# EAGLE design licht (EAGLE 6.6.0)
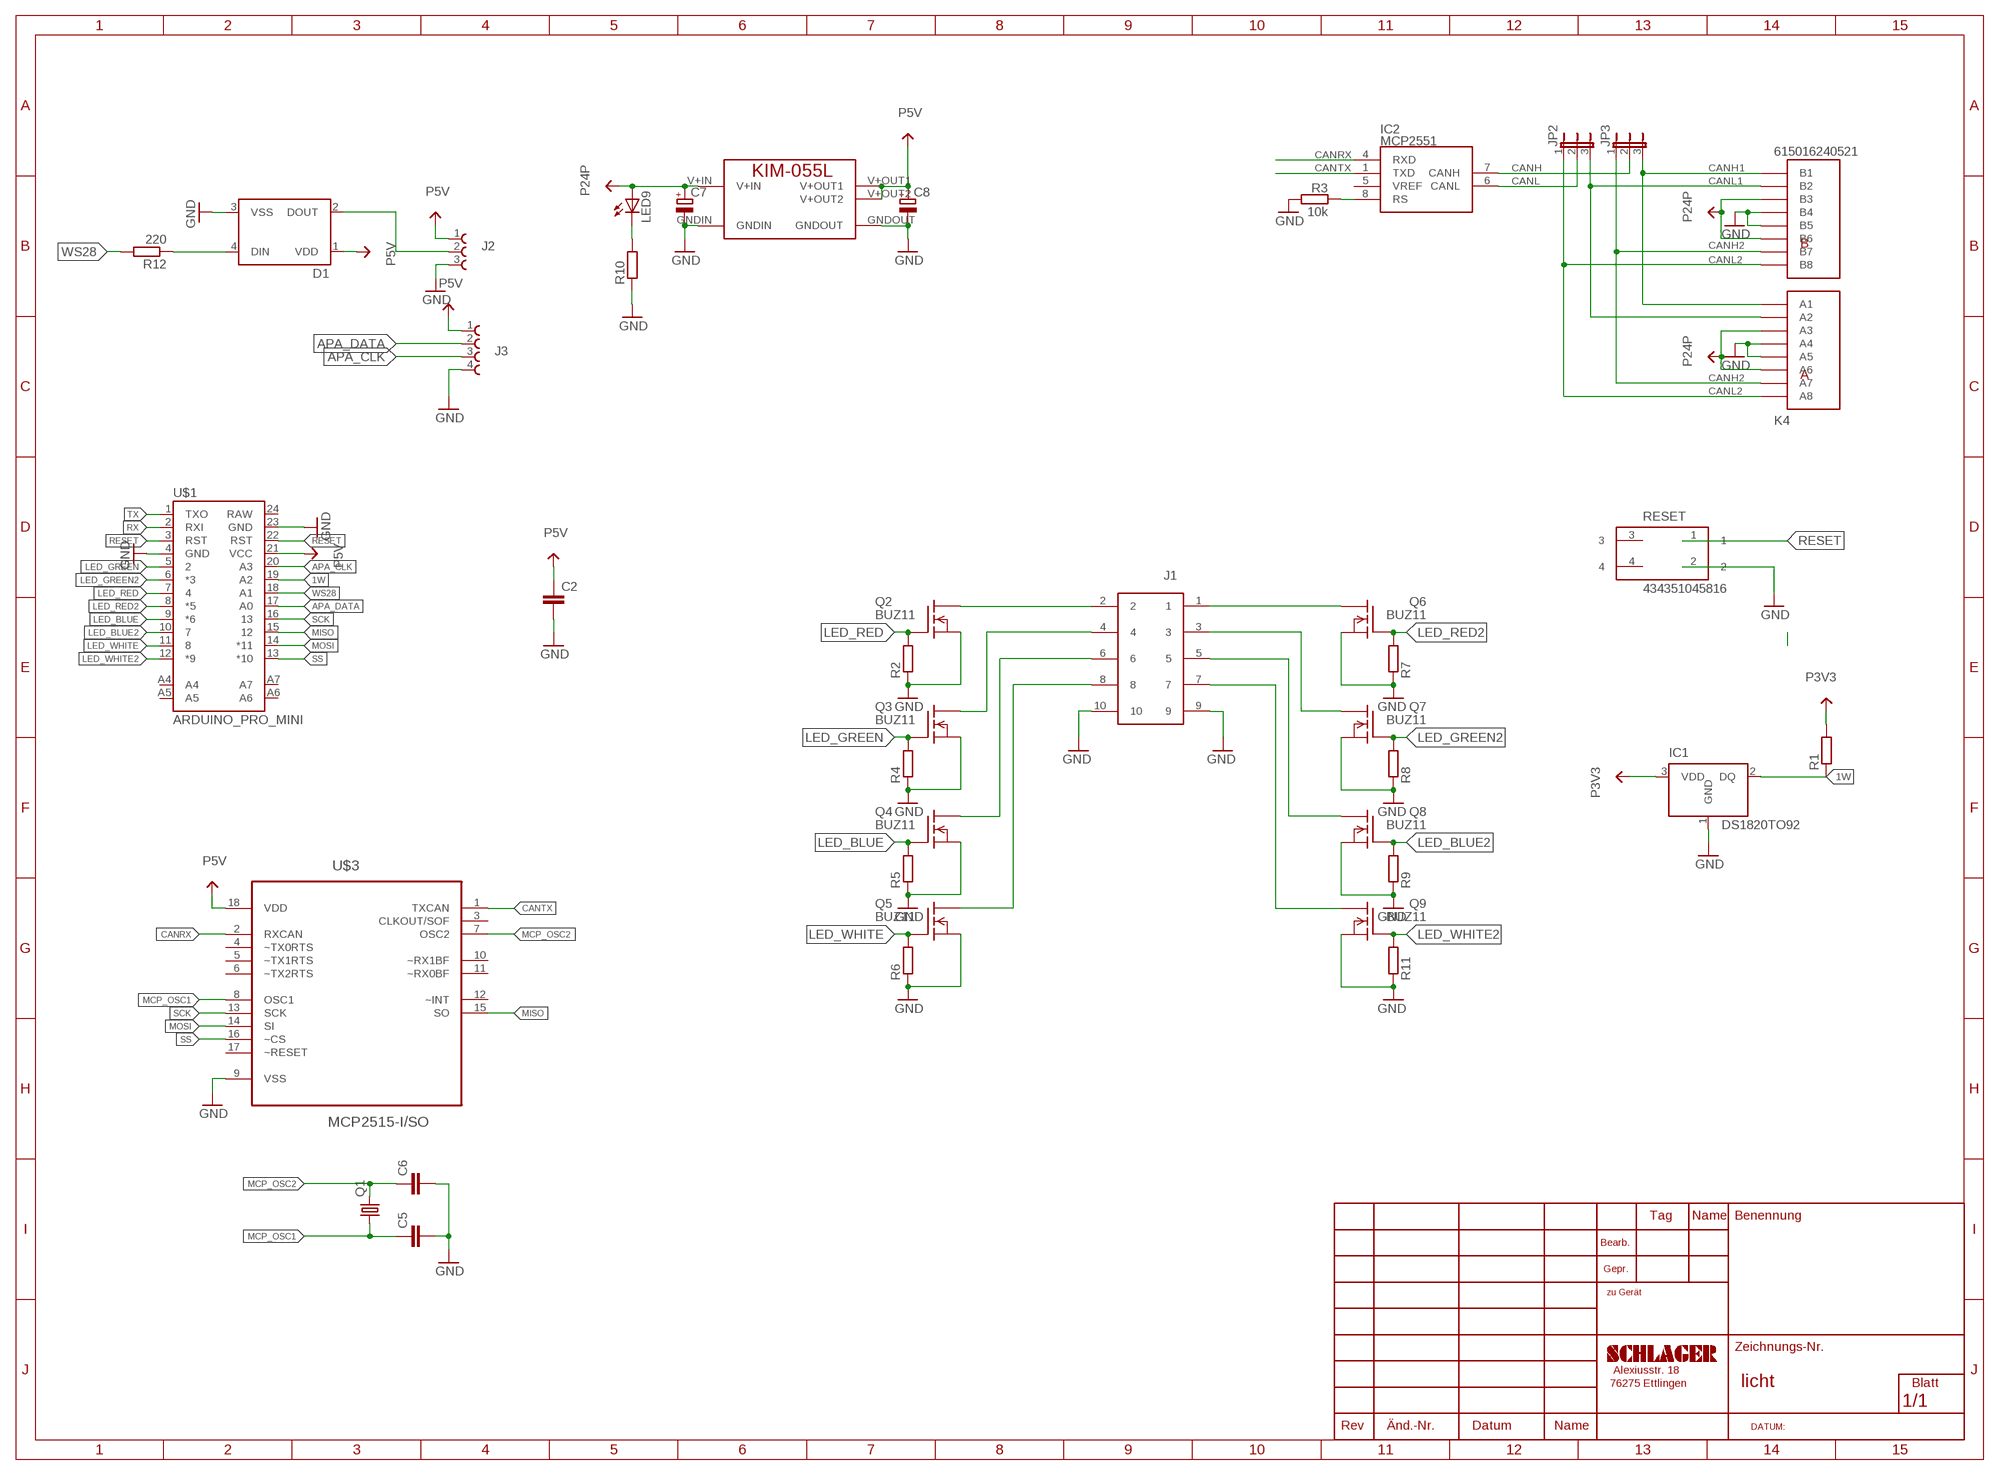
[diagram p0: schematic, sheet 1]

## Parts
C2  C-EUC0805  [C0805]
C5  C-EUC0805  [C0805]
C6  C-EUC0805  [C0805]
C7  CPOL-EUE5-10.5  [E5-10,5]
C8  CPOL-EUE5-10.5  [E5-10,5]
D1  WS2812B  [WS2812B]
IC1  DS1820TO92  [TO-92]
IC2  MCP2551  [SO-8]
J1  691331510010  [691331510010]
J2  691322310003  [691322310003]
J3  691322310004  [691322310004]
JP2  JP2E  [JP2]
JP3  JP2E  [JP2]
K4  615016240521  [615016240521]
LED9  LED3MM  [LED3MM]
MOD1  KIM-055L  [KIM-055L]
Q1  CRYSTALHC49S  [HC49/S]
Q2  BUZ11  [TO220V]
Q3  BUZ11  [TO220V]
Q4  BUZ11  [TO220V]
Q5  BUZ11  [TO220V]
Q6  BUZ11  [TO220V]
Q7  BUZ11  [TO220V]
Q8  BUZ11  [TO220V]
Q9  BUZ11  [TO220V]
R1  R-EU_M0805  [M0805]
R2  R-EU_R0805  [R0805]
R3  10k  R-EU_R0603  [R0603]
R4  R-EU_R0805  [R0805]
R5  R-EU_R0805  [R0805]
R6  R-EU_R0805  [R0805]
R7  R-EU_R0805  [R0805]
R8  R-EU_R0805  [R0805]
R9  R-EU_R0805  [R0805]
R10  R-EU_R0805  [R0805]
R11  R-EU_R0805  [R0805]
R12  220  R-EU_R0805  [R0805]
RESET  434351045816  [434351045816]
U$1  ARDUINO_PRO_MINI  [ARDUINO_PRO_MINI]
U$3  MCP2515-I/SO  [SOIC127P1034X264-18N]

## Nets
1W: IC1.2(DQ) R1.1 U$1.19(A2)
APA_CLK: J3.3 U$1.20(A3)
APA_DATA: J3.2 U$1.17(A0)
CANH: IC2.7(CANH) JP3.2
CANH1: JP3.3 K4.A1 K4.B1
CANH2: JP3.1 K4.A7 K4.B7
CANL: IC2.6(CANL) JP2.2
CANL1: JP2.3 K4.A2 K4.B2
CANL2: JP2.1 K4.A8 K4.B8
CANRX: IC2.4(RXD) U$3.2(RXCAN)
CANTX: IC2.1(TXD) U$3.1(TXCAN)
GND: C2.2 C5.2 C6.2 C7.- C8.- D1.3(VSS) IC1.1(GND) J1.9 J1.10 J2.3 J3.4 K4.A4 K4.A5 K4.B4 K4.B5 MOD1.GNDIN MOD1.GNDOUT Q2.3(S) Q3.3(S) Q4.3(S) Q5.3(S) Q6.3(S) Q7.3(S) Q8.3(S) Q9.3(S) R2.1 R3.2 R4.1 R5.1 R6.1 R7.1 R8.1 R9.1 R10.1 R11.1 RESET.2 U$1.4(GND) U$1.23(GND) U$3.9(VSS)
LED_BLUE: Q4.1(G) R5.2 U$1.9(*6)
LED_BLUE2: Q8.1(G) R9.2 U$1.10
LED_GREEN: Q3.1(G) R4.2 U$1.5
LED_GREEN2: Q7.1(G) R8.2 U$1.6(*3)
LED_RED: Q2.1(G) R2.2 U$1.7
LED_RED2: Q6.1(G) R7.2 U$1.8(*5)
LED_WHITE: Q5.1(G) R6.2 U$1.11
LED_WHITE2: Q9.1(G) R11.2 U$1.12(*9)
MCP_OSC1: C5.1 Q1.1 U$3.8(OSC1)
MCP_OSC2: C6.1 Q1.2 U$3.7(OSC2)
MISO: U$1.15 U$3.15(SO)
MOSI: U$1.14(*11) U$3.14(SI)
N$1: J1.2 Q2.2(D)
N$2: IC2.8(RS) R3.1
N$3: J1.4 Q3.2(D)
N$4: J1.5 Q8.2(D)
N$5: J1.6 Q4.2(D)
N$6: J1.8 Q5.2(D)
N$7: J1.7 Q9.2(D)
N$8: J1.1 Q6.2(D)
N$9: LED9.K(C) R10.2
N$10: J1.3 Q7.2(D)
N$11: D1.2(DOUT) J2.2
N$12: D1.4(DIN) R12.1
P3V3: IC1.3(VDD) R1.2
P5V: C2.1 C8.+ D1.1(VDD) J2.1 J3.1 MOD1.V+OUT1 MOD1.V+OUT2 U$1.21(VCC) U$3.18(VDD)
P24P: C7.+ K4.A3 K4.A6 K4.B3 K4.B6 LED9.A MOD1.V+IN
RESET: RESET.1 U$1.3(RST) U$1.22(RST)
RX: U$1.2(RXI)
SCK: U$1.16 U$3.13(SCK)
SS: U$1.13(*10) U$3.16(~CS)
TX: U$1.1(TXO)
WS28: R12.2 U$1.18(A1)
Unconnected: IC2.2(GND) IC2.3(VCC) IC2.5(VREF) RESET.3 RESET.4 U$1.24(RAW) U$1.A4 U$1.A5 U$1.A6 U$1.A7 U$3.3(CLKOUT/SOF) U$3.4(~TX0RTS) U$3.5(~TX1RTS) U$3.6(~TX2RTS) U$3.10(~RX1BF) U$3.11(~RX0BF) U$3.12(~INT) U$3.17(~RESET)

## Library data of the parts
C2 C5 C6 = schlager_passiv:C-EU: CAPACITOR, European symbol
C7 C8 = schlager_passiv:CPOL-EU: POLARIZED CAPACITOR, European symbol
D1 = SparkFun-LED:WS2812B: WS2812B - Intelligent control LED integrated light source Technical Specifications: Power Supply Voltage (VDD): 3.5 to 5.3 V Input Voltage (VI): -0.5 to VDD+0.5 V Operating Junction Temperature (Topt): -25°C to +80°C Storage Temperature Range (Tstg): -55°C to +150°C; PROD_ID: DIO-12503
IC1 = schlager_ics:DS1820: DS1820 - 1-Wire Digital Thermometer
IC2 = MYMCHIP:MCP2551: CAN Transceiver
J1 = Eagle_TERMINAL_BLOCKS_rev16a:691331510010: WR-TBL Serie 3315 – 5.08mm Close Horizontal Dual Row PCB Header, 10 Pins=>Code : Con_TBL_Pluggable_5.08_PCB_THT_Double_H_691331510010 <http://katalog.we-online.de/media/images/eican/Con_TBL_Pluggable_5.08_PCB_THT_Double_H_6913315100xx_pf2.jpg> Details see: http://katalog.we-online.de/en/em/691_331_510_0xx Created 2014-06-25, Karrer Zheng 2014 (C) Würth Elektronik
J2 = Eagle_TERMINAL_BLOCKS_rev16a:691322310003: WR-TBL Serie 322 - 3.81mm Vertical PCB Header , 3 Pins=>Code : Con_TBL_Pluggable_3.81_PCB_THT_Simple_691322310003 <http://katalog.we-online.de/media/images/eican/Con_TBL_Pluggable_3.81_PCB_THT_Simple_6913223100xx_pf2.jpg> Details see: http://katalog.we-online.de/en/em/691_322_310_0xx Created 2014-06-19, Karrer Zheng 2014 (C) Würth Elektronik
J3 = Eagle_TERMINAL_BLOCKS_rev16a:691322310004: WR-TBL Serie 322 - 3.81mm Vertical PCB Header , 4 Pins=>Code : Con_TBL_Pluggable_3.81_PCB_THT_Simple_691322310004 <http://katalog.we-online.de/media/images/eican/Con_TBL_Pluggable_3.81_PCB_THT_Simple_6913223100xx_pf2.jpg> Details see: http://katalog.we-online.de/en/em/691_322_310_0xx Created 2014-06-19, Karrer Zheng 2014 (C) Würth Elektronik
JP2 JP3 = jumper:JP2E: JUMPER
K4 = Wuerth_Elektronik_eiCan_Communication_Connectors:615016240521: WR-MJ Horizontal Shielded Dual Stacked Port with EMI Panel Finger 8P8C Modular Jack Tab Up & Down, 16 Pins
LED9 = led:LED: LED OSRAM: - CHIPLED LG R971, LG N971, LY N971, LG Q971, LY Q971, LO R971, LY R971 LH N974, LH R974 LS Q976, LO Q976, LY Q976 LO Q996 - Hyper CHIPLED LW Q18S LB Q993, LB Q99A, LB R99A - SideLED LS A670, LO A670, LY A670, LG A670, LP A670 LB A673, LV A673, LT A673, LW A673 LH A674 LY A675 LS A676, LA A676, LO A676, LY A676, LW A676 LS A679, LY A679, LG A679 - Hyper Micro SIDELED® LS Y876, LA Y876, LO Y876, LY Y876 LT Y87S - SmartLED LW L88C, LW L88S LB L89C, LB L89S, LG L890 LS L89K, LO L89K, LY L89K LS L896, LA L896, LO L896, LY L896 - TOPLED LS T670, LO T670, LY T670, LG T670, LP T670 LSG T670, LSP T670, LSY T670, LOP T670, LYG T670 LG T671, LOG T671, LSG T671 LB T673, LV T673, LT T673, LW T673 LH T674 LS T676, LA T676, LO T676, LY T676, LB T676, LH T676, LSB T676, LW T676 LB T67C, LV T67C, LT T67C, LS T67K, LO T67K, LY T67K, LW E67C LS E67B, LA E67B, LO E67B, LY E67B, LB E67C, LV E67C, LT E67C LW T67C LS T679, LY T679, LG T679 LS T770, LO T770, LY T770, LG T770, LP T770 LB T773, LV T773, LT T773, LW T773 LH T774 LS E675, LA E675, LY E675, LS T675 LS T776, LA T776, LO T776, LY T776, LB T776 LHGB T686 LT T68C, LB T68C - Hyper Mini TOPLED® LB M676 - Mini TOPLED Santana® LG M470 LS M47K, LO M47K, LY M47K Source: http://www.osram.convergy.de LUXEON: - LUMILED® LXK2-PW12-R00, LXK2-PW12-S00, LXK2-PW14-U00, LXK2-PW14-V00 LXK2-PM12-R00, LXK2-PM12-S00, LXK2-PM14-U00 LXK2-PE12-Q00, LXK2-PE12-R00, LXK2-PE12-S00, LXK2-PE14-T00, LXK2-PE14-U00 LXK2-PB12-K00, LXK2-PB12-L00, LXK2-PB12-M00, LXK2-PB14-N00, LXK2-PB14-P00, LXK2-PB14-Q00 LXK2-PR12-L00, LXK2-PR12-M00, LXK2-PR14-Q00, LXK2-PR14-R00 LXK2-PD12-Q00, LXK2-PD12-R00, LXK2-PD12-S00 LXK2-PH12-R00, LXK2-PH12-S00 LXK2-PL12-P00, LXK2-PL12-Q00, LXK2-PL12-R00 Source: www.luxeon.com KINGBRIGHT: KA-3528ASYC Source: www.kingbright.com
MOD1 = kim055l:KIM-055L: 5V 5amp DC DC module. IMPORANT: Add low ESR input & output capacitors. V+OUT1 & V+OUT2 internally connected.
Q1 = crystal:CRYSTAL: CRYSTAL; OC_FARNELL: 1667008; OC_NEWARK: unknown
Q2-Q9 = transistor-fet:BUZ11: N-Channel Enhancement MOSFET 50V; 30A; 0,040Ohm
R1 R2 R4-R12 = schlager_passiv:R-EU_: RESISTOR, European symbol
R3 = rcl:R-EU_: RESISTOR, European symbol
RESET = Illuminated_Switches:434351045816: WS-TUS-3.5x4.7 mm side push SMD Tact Switch, 4 pins
U$1 = SparkFun-Boards:ARDUINO_PRO_MINI
U$3 = schlager_ics:MCP2515-I/SO: CAN Controller; MPN: MCP2515-I/SO; OC_FARNELL: 1292239; OC_NEWARK: 29H7136; PACKAGE: SOIC-18; SUPPLIER: Microchip

## Net classes
4 USBpair: width 0.254 mm, drill 0.406 mm, clearance 0.508 mm

## Board
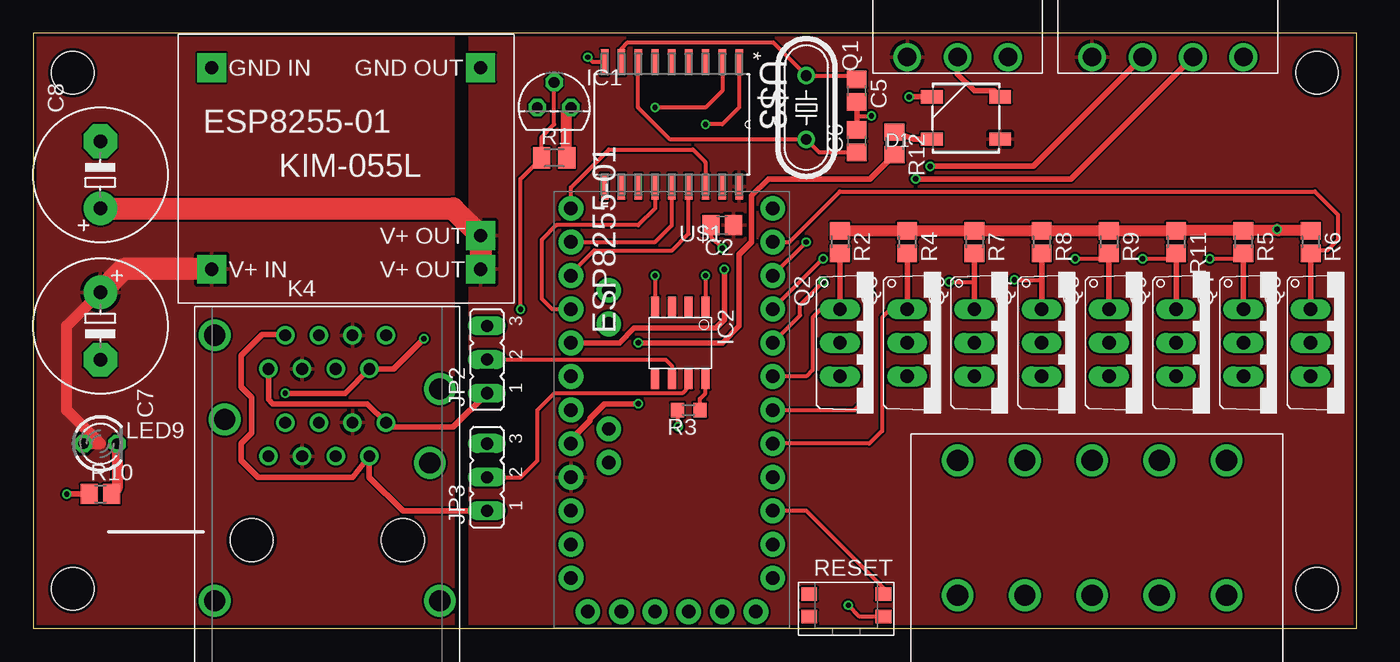
[diagram p1: board, top side]
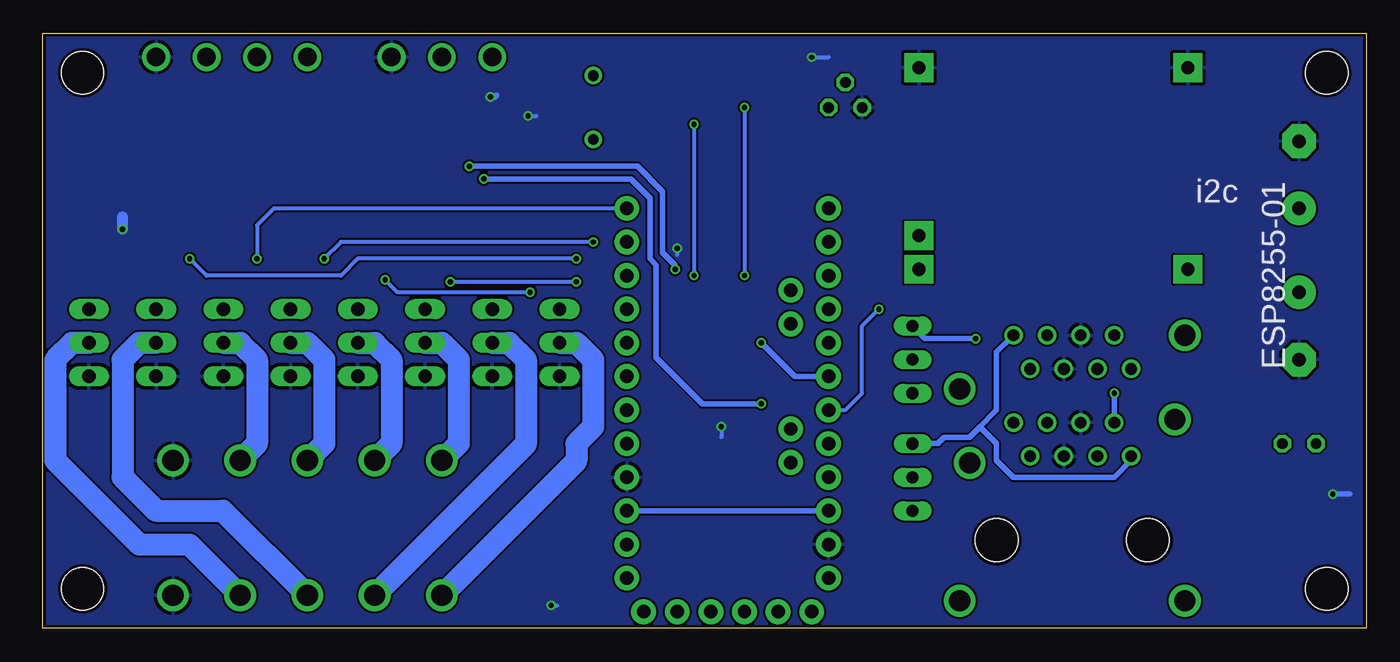
[diagram p2: board, bottom side, seen from below]

Size 100 x 45 mm. Coordinates in mm from the lower left corner, seen from the top.
Outline: 0,0 100,0 100,45 0,45 0,0
Copper layers (1*16): Top 0.035mm / dielectric 1.5mm / Bottom 0.035mm
Design rules "ITEADstudio_DRC": minimum track width 6mil, minimum drill 12mil, track to track 6mil, track to pad 6mil, pad to pad 6mil, via to via 6mil, smd to smd 0mil, copper to edge 10mil, drill to drill 10mil, minimum pad ring 10mil, minimum via ring 6mil, stop-mask expansion 2mil, vias tented up to drill 100mil, thermal gap 10mil
Holes 3.2 mm at 3,3 3,42 97,42 97,3

### Footprints (pad centres in the part's own frame; a part is rotated, then mirrored left to right if it is on the bottom)
C0805 = smd 1.3 x 1.5: 1 -0.85,0; 2 0.85,0
E5-10,5 = drill 1.016 pad 2.54: + -2.54,0 | drill 1.016 pad 2.54 octagon: - 2.54,0
WS2812B = smd 1.651 x 1: 1 -2.577,1.6; 2 -2.577,-1.6; 3 2.577,-1.6; 4 2.577,1.6
TO-92 = drill 0.813 pad 1.27 octagon: 1 -1.27,0; 2 0,1.905; 3 1.27,0
SO-8 = smd 0.61 x 1.524: 1 0,-0.203; 2 1.27,-0.203; 3 2.54,-0.203; 4 3.81,-0.203; 5 3.81,5.283; 6 2.54,5.283; 7 1.27,5.283; 8 0,5.283
691331510010 = drill 1.6: 1 0,0; 2 10.2,0; 3 0,5.08; 4 10.2,5.08; 5 0,10.16; 6 10.2,10.16; 7 0,15.24; 8 10.2,15.24; 9 0,20.32; 10 10.2,20.32
691322310003 = drill 1.4: 1 -3.81,0; 2 0,0; 3 3.81,0
691322310004 = drill 1.4: 1 -3.81,0; 2 0,0; 3 3.81,0; 4 7.62,0
JP2 = drill 0.914 long: 1 -2.54,0; 2 0,0; 3 2.54,0
615016240521 = drill 0.89: A1 -4.445,-1.27; A2 -3.175,1.27; A3 -1.905,-1.27; A4 -0.635,1.27; A5 0.635,-1.27; A6 1.905,1.27; A7 3.175,-1.27; A8 4.445,1.27; B1 4.445,7.87; B2 3.175,5.33; B3 1.905,7.87; B4 0.635,5.33; B5 -0.635,7.87; B6 -1.905,5.33; B7 -3.175,7.87; B8 -4.445,5.33 | drill 1.6: Z1 -8.505,-12.19; Z2 8.505,-12.19; Z3 7.745,-1.78; Z4 -7.745,1.52; Z5 8.505,3.81; Z6 -8.505,7.87 | hole 3.25: -5.715,-7.62; 5.715,-7.62
LED3MM = drill 0.813 octagon: A -1.27,0; K 1.27,0
KIM-055L = drill 1 pad 2.184 square: GNDIN -10.16,7.62; GNDOUT 10.16,7.62; V+IN -10.16,-7.62; V+OUT1 10.16,-5.08; V+OUT2 10.16,-7.62
HC49/S = drill 0.813: 1 -2.413,0; 2 2.413,0
TO220V = drill 1.016 long: 1 -2.54,-2.54; 2 0,-2.54; 3 2.54,-2.54
M0805 = smd 1.3 x 1.6: 1 -0.95,0; 2 0.95,0
R0805 = smd 1.3 x 1.5: 1 -0.85,0; 2 0.85,0
R0603 = smd 1 x 1.1: 1 -0.85,0; 2 0.85,0
434351045816 = smd 1.2 x 1: 1 2.8,0.85; 2 2.8,-0.85; 3 -2.8,0.85; 4 -2.8,-0.85
ARDUINO_PRO_MINI = drill 1.016 pad 1.88: 1 -7.62,12.7; 2 -7.62,10.16; 3 -7.62,7.62; 4 -7.62,5.08; 5 -7.62,2.54; 6 -7.62,0; 7 -7.62,-2.54; 8 -7.62,-5.08; 9 -7.62,-7.62; 10 -7.62,-10.16; 11 -7.62,-12.7; 12 -7.62,-15.24; 13 7.62,-15.24; 14 7.62,-12.7; 15 7.62,-10.16; 16 7.62,-7.62; 17 7.62,-5.08; 18 7.62,-2.54; 19 7.62,0; 20 7.62,2.54; 21 7.62,5.08; 22 7.62,7.62; 23 7.62,10.16; 24 7.62,12.7; A4 4.763,1.429; A5 4.763,3.969; A6 4.763,-9.049; A7 4.763,-6.509; BLK -6.35,15.24; GND -3.81,15.24; GRN 6.35,15.24; RXI 1.27,15.24; TXO 3.81,15.24; VCC -1.27,15.24
SOIC127P1034X264-18N = smd 1.981 x 0.559: 1 -4.699,5.08; 2 -4.699,3.81; 3 -4.699,2.54; 4 -4.699,1.27; 5 -4.699,0; 6 -4.699,-1.27; 7 -4.699,-2.54; 8 -4.699,-3.81; 9 -4.699,-5.08; 10 4.699,-5.08; 11 4.699,-3.81; 12 4.699,-2.54; 13 4.699,-1.27; 14 4.699,0; 15 4.699,1.27; 16 4.699,2.54; 17 4.699,3.81; 18 4.699,5.08

### Placement (x,y rotation side)
C2  52.07,30.48 180 top
C5  62.23,40.64 270 top
C6  62.23,36.83 90 top
C7  5.08,22.86 270 top
C8  5.08,34.29 90 top
D1  70.48,38.58 180 top
IC1  39.37,39.37 0 top
IC2  50.8,24.13 180 top
J1  69.85,12.7 270 top
J2  69.85,43.18 0 top
J3  83.82,43.18 0 top
JP2  34.29,20.32 90 top
JP3  34.29,11.43 90 top
K4  22.23,14.29 0 top
LED9  5.08,13.97 0 top
MOD1  23.65,34.77 0 top
Q1  58.42,39.37 270 top
Q2  63.5,21.59 270 top
Q3  68.58,21.59 270 top
Q4  93.98,21.59 270 top
Q5  99.06,21.59 270 top
Q6  73.66,21.59 270 top
Q7  78.74,21.59 270 top
Q8  83.82,21.59 270 top
Q9  88.9,21.59 270 top
R1  39.37,35.56 0 top
R2  60.96,29.21 270 top
R3  49.53,16.51 180 top
R4  66.04,29.21 270 top
R5  91.44,29.21 270 top
R6  96.52,29.21 270 top
R7  71.12,29.21 270 top
R8  76.2,29.21 270 top
R9  81.28,29.21 270 top
R10  5.08,10.16 0 top
R11  86.36,29.21 270 top
R12  65.09,36.67 270 top
RESET  61.44,1.75 0 top
U$1  48.26,16.51 180 top
U$3  48.26,38.1 270 top

### Tracks (layer width: path | path; a pad name or v marks a point on that pad's centre or on a via)
1W  (via drill 0.4)
  Top 0.305: IC1.2 39.37,38.1 38.42,37.15 R1.1 36.83,33.97 v36.83,24.13
  Bottom 0.305: U$1.19 39.37,16.51 38.1,17.78 38.1,22.86 v36.83,24.13
APA_CLK  (via drill 0.4)
  Top 0.406: U$1.20 40.64,14.29 42.07,15.72 42.07,15.88 43.18,16.99 v45.72,16.99 | v66.67,33.97 78.42,33.97 J3.3
  Bottom 0.406: v45.72,16.99 50.16,16.99 53.66,20.48 53.66,27.46 54.13,27.94 54.13,32.54 55.56,33.97 v66.67,33.97
APA_DATA  (via drill 0.4)
  Top 0.406: U$1.17 44.29,21.59 45.4,22.7 51.59,22.7 52.23,23.34 v52.23,27.15 | v67.79,34.92 75.56,34.92 J3.2
  Bottom 0.406: v52.23,27.15 52.23,27.46 53.18,28.42 53.18,33.02 55.09,34.92 v67.79,34.92
CANH
  Top 0.305: JP3.2 36.83,11.43 38.1,12.7 38.1,16.51 39.37,17.78 49.05,17.78 49.53,18.26 IC2.7
CANH1
  Bottom 0.406: JP3.3 32.38,13.97 31.91,14.45 30,14.45 29.21,15.24 | 29.21,15.24 27.94,16.51 27.94,20.89 K4.B1 | K4.A1 17.78,12.7 19.05,11.43 26.67,11.43 27.94,12.7 27.94,13.97 29.21,15.24
CANH2
  Top 0.406: JP3.1 27.94,8.89 25.4,11.43 K4.A7 24.13,11.43 16.99,11.43 15.72,12.7 15.72,13.97 16.51,14.76 16.51,17.46 15.72,18.26 15.72,20.64 17.3,22.23 18.98,22.23 K4.B7
CANL
  Top 0.305: JP2.2 47.78,20.32 48.26,19.84 IC2.6
CANL1  (via drill 0.4)
  Top 0.406: v19.05,17.78 23.56,17.78 K4.B2 27.24,19.62 v29.53,21.91
  Bottom 0.406: K4.A2 v19.05,17.78 | v29.53,21.91 33.34,21.91 JP2.3
CANL2
  Top 0.406: JP2.1 31.75,15.24 26.99,15.24 K4.A8 25.24,16.99 18.1,16.99 17.78,17.3 K4.B8
CANRX  (via drill 0.4)
  Top 0.305: U$3.2 52.07,40.64 50.8,39.37 v46.99,39.37 | v46.99,26.67 IC2.4
  Bottom 0.305: v46.99,39.37 v46.99,26.67
CANTX  (via drill 0.4)
  Top 0.305: U$3.1 53.34,39.37 52.07,38.1 v50.8,38.1 | v50.8,26.67 IC2.1
  Bottom 0.305: v50.8,38.1 v50.8,26.67
GND  (via drill 0.4)
  Top 0.305: U$3.9 42.29,42.8 v41.91,43.18 | RESET.2 62.45,0.9 v61.59,1.75 | R3.2 48.68,15.3 v48.74,15.24 | C2.2 51.22,29.58 v52.07,28.73 | 62.23,38.73 v63.34,38.73
  Top 0.406: R10.1 v2.54,10.16 | C5.2 62.23,38.73 C6.2 | D1.3 66.21,40.18 v66.2,40.16
  Top 0.813: R2.1 R4.1 R7.1 R8.1 R9.1 R11.1 R5.1 R6.1 94.08,30.06 v93.98,30.16
  Bottom 0.305: v41.91,43.18 40.64,43.18 | v61.59,1.75 61.12,1.75 | v48.74,15.24 48.74,14.45 | v52.07,28.73 52.07,28.26 | v63.34,38.73 62.71,38.73
  Bottom 0.406: v2.54,10.16 1.27,10.16 | v66.2,40.16 65.88,40.16 65.72,40.32
  Bottom 0.813: v93.98,30.16 93.98,31.11
  pour Bottom: -8.89,72.39 120.65,72.39 120.65,-13.97 -8.89,-13.97
LED_BLUE  (via drill 0.4)
  Top 0.305: U$1.9 v59.69,27.94 | v88.9,27.94 91.02,27.94 R5.2
  Top 0.406: Q4.1 R5.2
  Bottom 0.305: v59.69,27.94 76.2,27.94 77.47,26.67 87.63,26.67 v88.9,27.94
LED_BLUE2  (via drill 0.4)
  Top 0.305: U$1.10 v58.42,29.21 | v78.74,27.94 80.86,27.94 R9.2
  Top 0.406: R9.2 Q8.1
  Bottom 0.305: v58.42,29.21 77.47,29.21 v78.74,27.94
LED_GREEN
  Top 0.305: Q3.1 64.77,24.13 64.14,23.5 64.14,14.92 63.18,13.97 U$1.5
  Top 0.406: R4.2 Q3.1
LED_GREEN2  (via drill 0.4)
  Top 0.305: U$1.6 62.07,16.51 63.18,17.62 v63.18,25.4 | v74.14,26.35 76.04,26.35 76.2,26.19
  Top 0.406: Q7.1 76.2,26.19 R8.2
  Bottom 0.305: v63.18,25.4 73.18,25.4 v74.14,26.35
LED_RED
  Top 0.305: Q2.1 59.53,24.13 58.9,23.5 58.9,19.53 58.42,19.05 U$1.7
  Top 0.406: R2.2 Q2.1
LED_RED2  (via drill 0.4)
  Top 0.305: U$1.8 57.94,23.65 57.94,24.45 v59.69,26.19 | v69.22,26.19 71.12,26.19
  Top 0.406: R7.2 71.12,26.19 Q6.1
  Bottom 0.305: v59.69,26.19 v69.22,26.19
LED_WHITE
  Top 0.305: U$1.11 57.15,29.21 60.96,33.02 96.84,33.02 98.58,31.27 98.58,29.37 97.79,28.57 96.73,28.57 R6.2
  Top 0.406: R6.2 Q5.1
LED_WHITE2  (via drill 0.4)
  Top 0.305: v83.82,27.94 85.94,27.94 R11.2
  Top 0.406: R11.2 Q9.1
  Bottom 0.305: U$1.12 82.55,31.75 83.82,30.48 v83.82,27.94
MCP_OSC1
  Top 0.305: U$3.8 44.45,43.81 44.93,44.29 55.91,44.29 Q1.1 61.94,41.78 C5.1
MCP_OSC2
  Top 0.305: U$3.7 45.72,39.37 48.13,36.96 Q1.2 59.4,35.98 C6.1
MISO
  Top 0.305: U$1.15 40.64,26.83 42.39,28.57 48.26,28.57 49.53,29.84 U$3.15
MOSI
  Top 0.305: U$1.14 46.99,29.21 48.26,30.48 U$3.14
N$1
  Bottom 1.676: Q2.2 59.69,21.59 58.42,20.32 58.42,15.24 59.69,13.97 59.69,12.66 J1.2
N$2
  Top 0.305: R3.1 50.38,17.36 50.8,17.78 IC2.8
N$3
  Bottom 1.676: Q3.2 64.77,21.59 63.5,20.32 63.5,13.93 J1.4
N$4
  Bottom 1.676: Q8.2 80.01,21.59 78.74,20.32 78.74,13.97 J1.5
N$5
  Bottom 1.676: Q4.2 92.71,21.59 93.98,20.32 93.98,11.43 91.44,8.89 86.4,8.89 J1.6
N$6
  Bottom 1.676: Q5.2 97.79,21.59 99.06,20.32 99.06,12.7 92.71,6.35 88.94,6.35 J1.8
N$7
  Bottom 1.676: Q9.2 85.09,21.59 83.82,20.32 83.82,13.97 J1.7
N$8
  Bottom 1.676: Q6.2 69.85,21.59 68.58,20.32 68.58,13.97 J1.1
N$9
  Top 0.813: LED9.K 6.35,10.58 R10.2
N$10
  Bottom 1.676: Q7.2 74.93,21.59 73.66,20.32 73.66,13.97 J1.3
N$11
  Top 0.406: J2.2 69.85,41.91 71.12,40.64 72.6,40.64 D1.2
N$12
  Top 0.406: D1.4 66.56,36.98 R12.1
P3V3
  Top 0.813: R1.2 40.32,39.05 IC1.3
P5V
  Top 1.676: C8.+ 31.75,31.75 MOD1.V+OUT1 MOD1.V+OUT2
  pour Top: 33.02,68.58 109.22,68.58 109.22,-13.97 33.02,-13.97
P24P
  Top 0.813: LED9.A 5.08,13.97 2.54,16.51 2.54,22.86 C7.+
  Top 1.676: MOD1.V+IN 6.83,27.15 C7.+
  pour Top: -16.51,68.58 31.75,68.58 31.75,-15.24 -16.51,-15.24
RESET
  Top 0.305: RESET.1 64.24,3.07 58.42,8.89 U$1.3
  Bottom 0.406: U$1.22 U$1.3
SCK
  Top 0.305: U$3.13 46.99,31.75 45.72,30.48 39.53,30.48 38.42,29.37 38.42,24.92 39.21,24.13 U$1.16
SS
  Top 0.305: U$1.13 40.64,33.34 43.5,36.2 49.85,36.2 50.8,35.24 U$3.16
WS28  (via drill 0.4)
  Top 0.406: v45.72,21.59 52.07,21.59 53.34,22.86 53.34,28.26 54.29,29.21 54.29,32.7 55.56,33.97 63.24,33.97 R12.2
  Bottom 0.406: U$1.18 43.18,19.05 v45.72,21.59

### Text on the board
tNames: ESP8255-01 | ESP8255-01
bNames: ESP8255-01 | i2c